# Altium schematic sheet keyboard_68.SchDoc
size A2
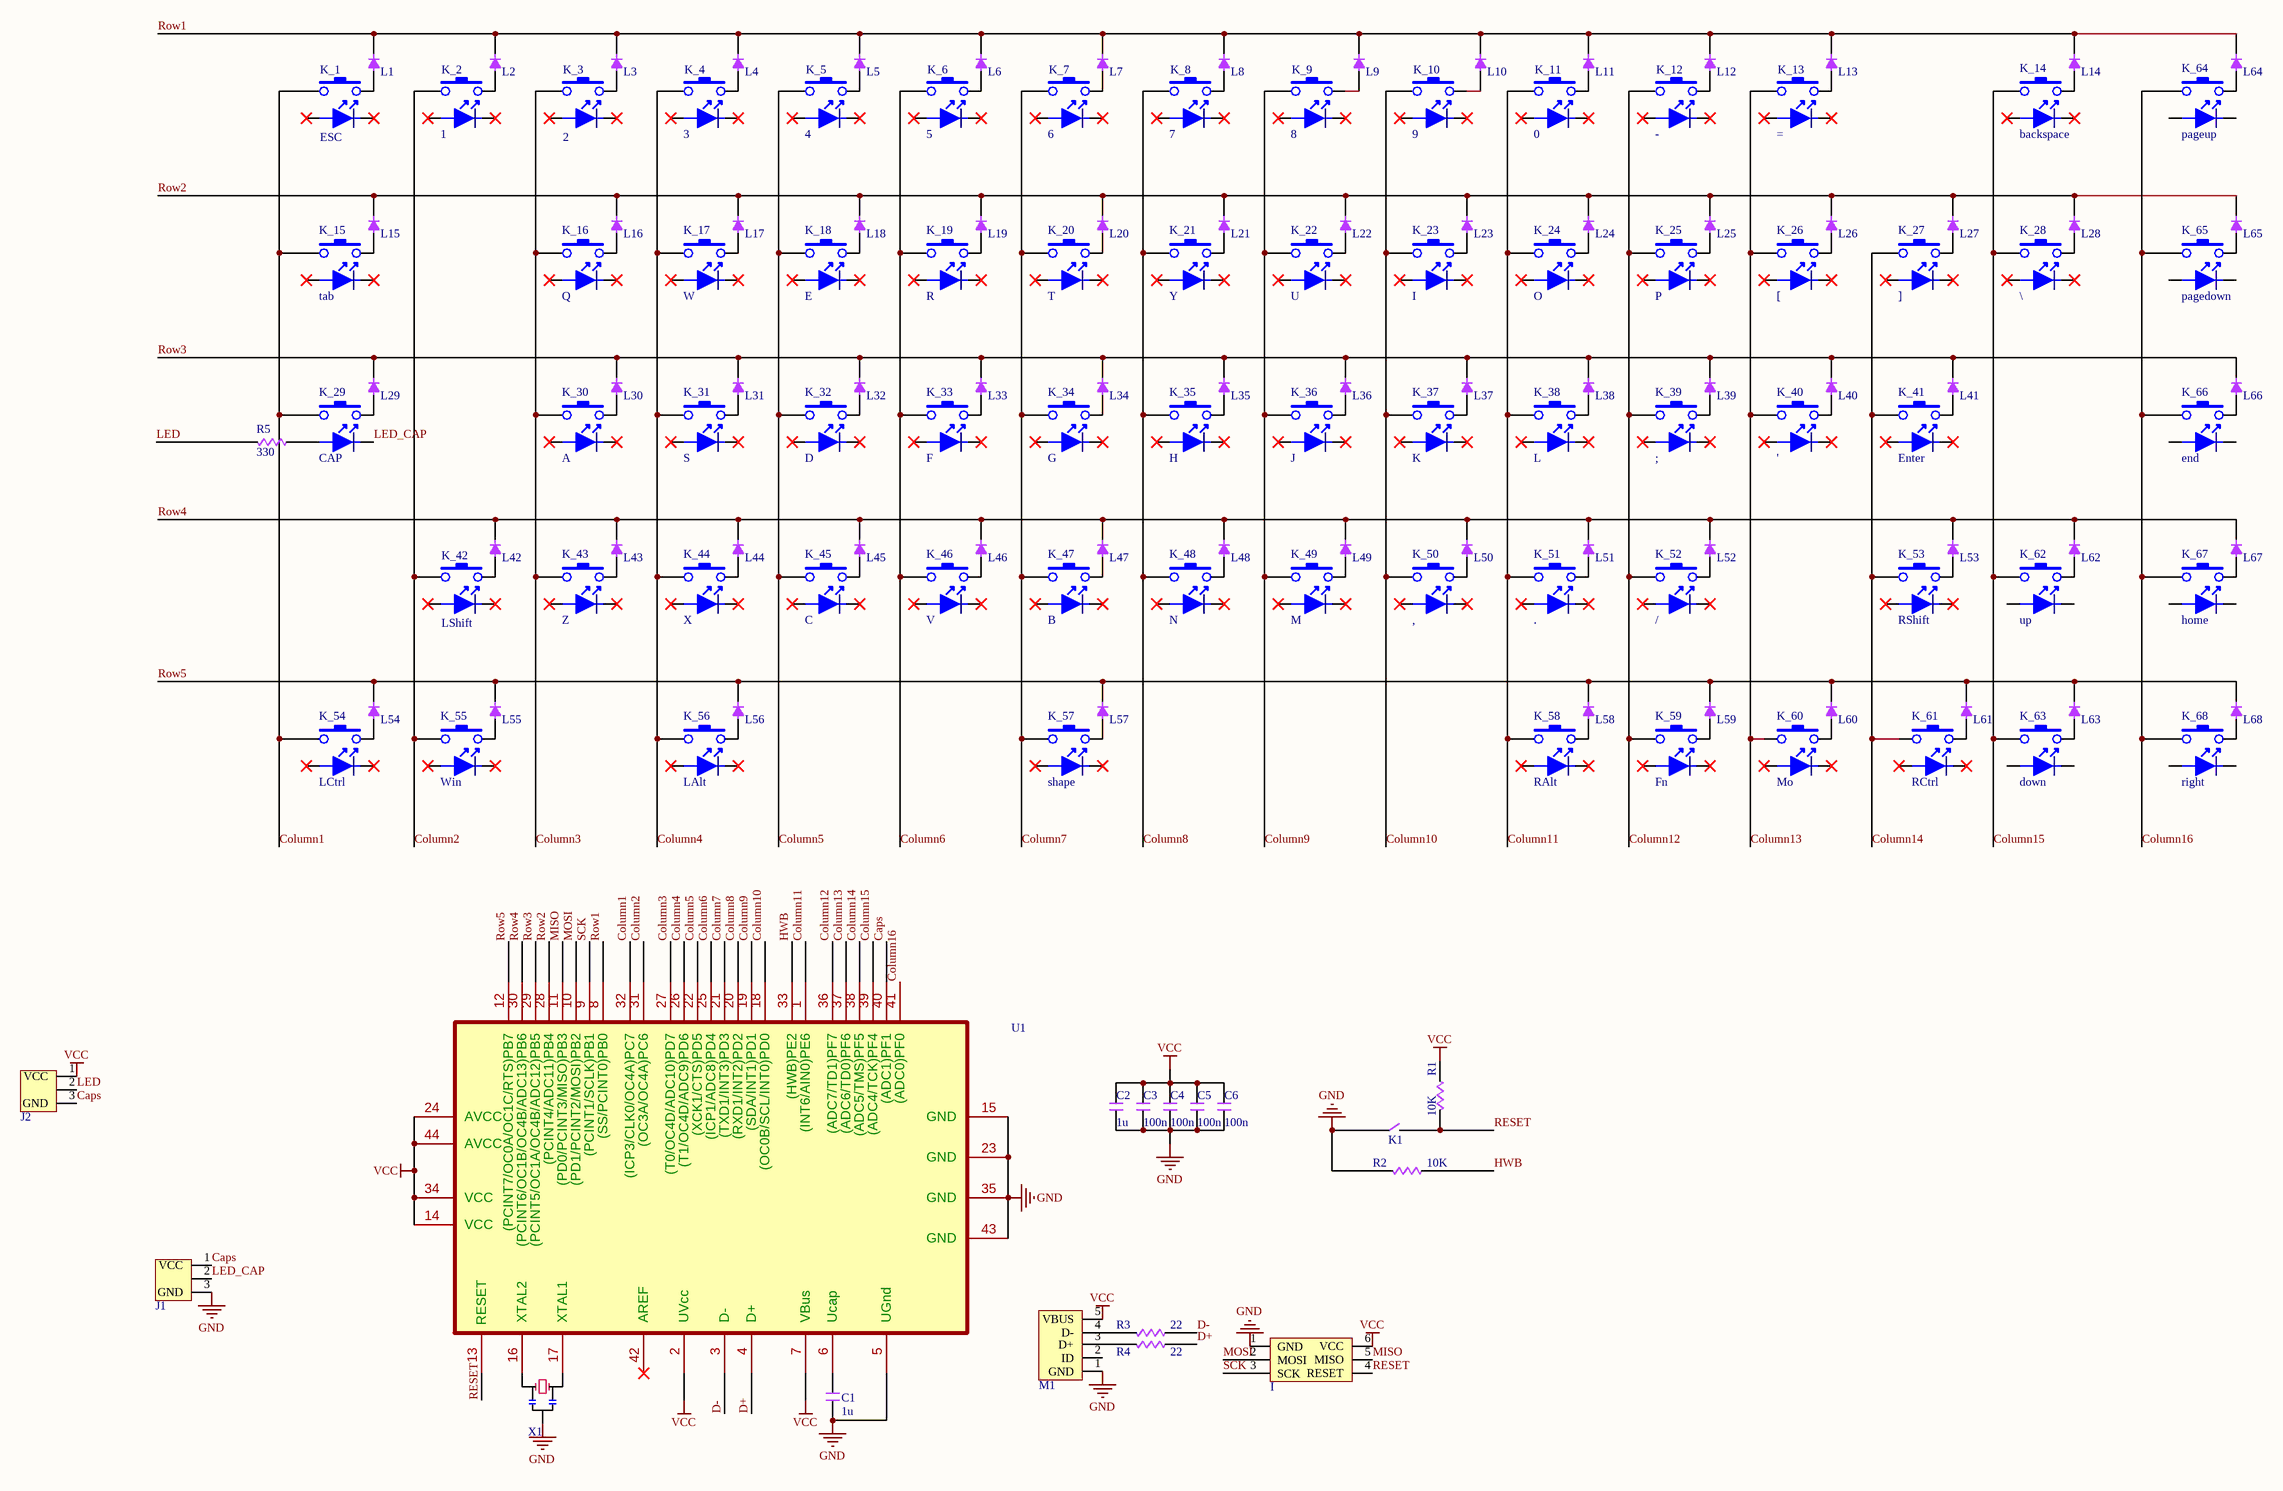
[diagram p0: keyboard_68.SchDoc]

## Parts
C1  value 1u  [C_0603]  (hidden comment: C)
C2  value 1u  [C_0603]  (hidden comment: C)
C3  value 100n  [C_0603]  (hidden comment: C)
C4  value 100n  [C_0603]  (hidden comment: C)
C5  value 100n  [C_0603]  (hidden comment: C)
C6  value 100n  [C_0603]  (hidden comment: C)
I  ISP  [ISP]  (value not drawn)
J1  Jump  [3PIN]  (value not drawn)
J2  Jump  [3PIN]  (value not drawn)
K1  SWITCH  [KEY]  (value not drawn)
K_1  ESC  [CHERRY]
K_2  1  [CHERRY]
K_3  2  [CHERRY]
K_4  3  [CHERRY]
K_5  4  [CHERRY]
K_6  5  [CHERRY]
K_7  6  [CHERRY]
K_8  7  [CHERRY]
K_9  8  [CHERRY]
K_10  9  [CHERRY]
K_11  0  [CHERRY]
K_12  -  [CHERRY]
K_13  (no value)  [CHERRY]
K_14  backspace  [KEY_CAP]
K_15  tab  [CHERRY]
K_16  Q  [CHERRY]
K_17  W  [CHERRY]
K_18  E  [CHERRY]
K_19  R  [CHERRY]
K_20  T  [CHERRY]
K_21  Y  [CHERRY]
K_22  U  [CHERRY]
K_23  I  [CHERRY]
K_24  O  [CHERRY]
K_25  P  [CHERRY]
K_26  [  [CHERRY]
K_27  ]  [CHERRY]
K_28  \  [CHERRY]
K_29  CAP  [CHERRY]
K_30  A  [CHERRY]
K_31  S  [CHERRY]
K_32  D  [CHERRY]
K_33  F  [CHERRY]
K_34  G  [CHERRY]
K_35  H  [CHERRY]
K_36  J  [CHERRY]
K_37  K  [CHERRY]
K_38  L  [CHERRY]
K_39  ;  [CHERRY]
K_40  '  [CHERRY]
K_41  Enter  [KEY_CAP]
K_42  LShift  [KEY_CAP]
K_43  Z  [CHERRY]
K_44  X  [CHERRY]
K_45  C  [CHERRY]
K_46  V  [CHERRY]
K_47  B  [CHERRY]
K_48  N  [CHERRY]
K_49  M  [CHERRY]
K_50  ,  [CHERRY]
K_51  .  [CHERRY]
K_52  /  [CHERRY]
K_53  RShift  [KEY_CAP]
K_54  LCtrl  [CHERRY]
K_55  Win  [CHERRY]
K_56  LAlt  [CHERRY]
K_57  shape  [SPACE_CAP]
K_58  RAlt  [CHERRY]
K_59  Fn  [CHERRY]
K_60  Mo  [CHERRY]
K_61  RCtrl  [CHERRY]
K_62  up  [CHERRY]
K_63  down  [CHERRY]
K_64  pageup  [CHERRY]
K_65  pagedown  [CHERRY]
K_66  end  [CHERRY]
K_67  home  [CHERRY]
K_68  right  [CHERRY]
L1  L  [L_0603]  (value not drawn)
L2  L  [L_0603]  (value not drawn)
L3  L  [L_0603]  (value not drawn)
L4  L  [L_0603]  (value not drawn)
L5  L  [L_0603]  (value not drawn)
L6  L  [L_0603]  (value not drawn)
L7  L  [L_0603]  (value not drawn)
L8  L  [L_0603]  (value not drawn)
L9  L  [L_0603]  (value not drawn)
L10  L  [L_0603]  (value not drawn)
L11  L  [L_0603]  (value not drawn)
L12  L  [L_0603]  (value not drawn)
L13  L  [L_0603]  (value not drawn)
L14  L  [L_0603]  (value not drawn)
L15  L  [L_0603]  (value not drawn)
L16  L  [L_0603]  (value not drawn)
L17  L  [L_0603]  (value not drawn)
L18  L  [L_0603]  (value not drawn)
L19  L  [L_0603]  (value not drawn)
L20  L  [L_0603]  (value not drawn)
L21  L  [L_0603]  (value not drawn)
L22  L  [L_0603]  (value not drawn)
L23  L  [L_0603]  (value not drawn)
L24  L  [L_0603]  (value not drawn)
L25  L  [L_0603]  (value not drawn)
L26  L  [L_0603]  (value not drawn)
L27  L  [L_0603]  (value not drawn)
L28  L  [L_0603]  (value not drawn)
L29  L  [L_0603]  (value not drawn)
L30  L  [L_0603]  (value not drawn)
L31  L  [L_0603]  (value not drawn)
L32  L  [L_0603]  (value not drawn)
L33  L  [L_0603]  (value not drawn)
L34  L  [L_0603]  (value not drawn)
L35  L  [L_0603]  (value not drawn)
L36  L  [L_0603]  (value not drawn)
L37  L  [L_0603]  (value not drawn)
L38  L  [L_0603]  (value not drawn)
L39  L  [L_0603]  (value not drawn)
L40  L  [L_0603]  (value not drawn)
L41  L  [L_0603]  (value not drawn)
L42  L  [L_0603]  (value not drawn)
L43  L  [L_0603]  (value not drawn)
L44  L  [L_0603]  (value not drawn)
L45  L  [L_0603]  (value not drawn)
L46  L  [L_0603]  (value not drawn)
L47  L  [L_0603]  (value not drawn)
L48  L  [L_0603]  (value not drawn)
L49  L  [L_0603]  (value not drawn)
L50  L  [L_0603]  (value not drawn)
L51  L  [L_0603]  (value not drawn)
L52  L  [L_0603]  (value not drawn)
L53  L  [L_0603]  (value not drawn)
L54  L  [L_0603]  (value not drawn)
L55  L  [L_0603]  (value not drawn)
L56  L  [L_0603]  (value not drawn)
L57  L  [L_0603]  (value not drawn)
L58  L  [L_0603]  (value not drawn)
L59  L  [L_0603]  (value not drawn)
L60  L  [L_0603]  (value not drawn)
L61  L  [L_0603]  (value not drawn)
L62  L  [L_0603]  (value not drawn)
L63  L  [L_0603]  (value not drawn)
L64  L  [L_0603]  (value not drawn)
L65  L  [L_0603]  (value not drawn)
L66  L  [L_0603]  (value not drawn)
L67  L  [L_0603]  (value not drawn)
L68  L  [L_0603]  (value not drawn)
M1  USB  [MICRO_USB]  (value not drawn)
R1  value 10K  [R_0603]  (hidden comment: R)
R2  value 10K  [R_0603]  (hidden comment: R)
R3  value 22  [R_0603]  (hidden comment: R)
R4  value 22  [R_0603]  (hidden comment: R)
R5  value 330  [R_0603]  (hidden comment: R)
U1  Atmega32U4  [TQFP80P1200X1200X120-44N]  (value not drawn)
X1  CSTCE  [CSTCE]  (value not drawn)

## Nets
GND: C1.1 C2.1 C3.1 C4.1 C5.1 C6.1 I.1(GND) J1.3(GND) K1.1(on) M1.1(GND) R2.1 U1.5(UGnd) U1.15(GND) U1.23(GND) U1.35(GND) U1.43(GND) X1.2(GND)
VCC: C2.2 C3.2 C4.2 C5.2 C6.2 I.6(VCC) J2.1(VCC) M1.5(VBUS) R1.2 U1.2(UVcc) U1.7(VBus) U1.14(VCC) U1.24(AVCC) U1.34(VCC) U1.44(AVCC)
Caps: J1.1(VCC) J2.3(GND) U1.40((ADC1)PF1)
Column1: K_1.1 K_15.1 K_29.1 K_54.1 U1.32((ICP3/CLK0/OC4A)PC7)
Column2: K_2.1 K_42.1 K_55.1 U1.31((OC3A/OC4A)PC6)
Column3: K_3.1 K_16.1 K_30.1 K_43.1 U1.27((T0/OC4D/ADC10)PD7)
Column4: K_4.1 K_17.1 K_31.1 K_44.1 K_56.1 U1.26((T1/OC4D/ADC9)PD6)
Column5: K_5.1 K_18.1 K_32.1 K_45.1 U1.22((XCK1/CTS)PD5)
Column6: K_6.1 K_19.1 K_33.1 K_46.1 U1.25((ICP1/ADC8)PD4)
Column7: K_7.1 K_20.1 K_34.1 K_47.1 K_57.1 U1.21((TXD1/INT3)PD3)
Column8: K_8.1 K_21.1 K_35.1 K_48.1 U1.20((RXD1/INT2)PD2)
Column9: K_9.1 K_22.1 K_36.1 K_49.1 U1.19((SDA/INT1)PD1)
Column10: K_10.1 K_23.1 K_37.1 K_50.1 U1.18((OC0B/SCL/INT0)PD0)
Column11: K_11.1 K_24.1 K_38.1 K_51.1 K_58.1 U1.1((INT6/AIN0)PE6)
Column12: K_12.1 K_25.1 K_39.1 K_52.1 K_59.1 U1.36((ADC7/TD1)PF7)
Column13: K_13.1 K_26.1 K_40.1 K_60.1 U1.37((ADC6/TD0)PF6)
Column14: K_27.1 K_41.1 K_53.1 K_61.1 U1.38((ADC5/TMS)PF5)
Column15: K_14.1 K_28.1 K_62.1 K_63.1 U1.39((ADC4/TCK)PF4)
Column16: K_64.1 K_65.1 K_66.1 K_67.1 K_68.1 U1.41((ADC0)PF0)
D+: R4.2 U1.4(D+)
D-: R3.2 U1.3(D-)
HWB: R2.2 U1.33((HWB)PE2)
LED: J2.2(MISO) R5.1
LED_CAP: J1.2(MISO) K_29.4
MISO: I.5(MISO) U1.11((PD0/PCINT3/MISO)PB3)
MOSI: I.2(MOSI) U1.10((PD1/PCINT2/MOSI)PB2)
RESET: I.4(RESET) K1.2(off) R1.1 U1.13(RESET)
Row1: L1.2 L2.2 L3.2 L4.2 L5.2 L6.2 L7.2 L8.2 L9.2 L10.2 L11.2 L12.2 L13.2 L14.2 L64.2 U1.8((SS/PCINT0)PB0)
Row2: L15.2 L16.2 L17.2 L18.2 L19.2 L20.2 L21.2 L22.2 L23.2 L24.2 L25.2 L26.2 L27.2 L28.2 L65.2 U1.28((PCINT4/ADC11)PB4)
Row3: L29.2 L30.2 L31.2 L32.2 L33.2 L34.2 L35.2 L36.2 L37.2 L38.2 L39.2 L40.2 L41.2 L66.2 U1.29((PCINT5/OC1A/OC4B/ADC12)PB5)
Row4: L42.2 L43.2 L44.2 L45.2 L46.2 L47.2 L48.2 L49.2 L50.2 L51.2 L52.2 L53.2 L62.2 L67.2 U1.30((PCINT6/OC1B/OC4B/ADC13)PB6)
Row5: L54.2 L55.2 L56.2 L57.2 L58.2 L59.2 L60.2 L61.2 L63.2 L68.2 U1.12((PCINT7/OC0A/OC1C/RTS)PB7)
SCK: I.3(SCK) U1.9((PCINT1/SCLK)PB1)
NetC1_2: C1.2 U1.6(Ucap)
NetK_1_2: K_1.2 L1.1(+)
NetK_2_2: K_2.2 L2.1(+)
NetK_3_2: K_3.2 L3.1(+)
NetK_4_2: K_4.2 L4.1(+)
NetK_5_2: K_5.2 L5.1(+)
NetK_6_2: K_6.2 L6.1(+)
NetK_7_2: K_7.2 L7.1(+)
NetK_8_2: K_8.2 L8.1(+)
NetK_9_2: K_9.2 L9.1(+)
NetK_10_2: K_10.2 L10.1(+)
NetK_11_2: K_11.2 L11.1(+)
NetK_12_2: K_12.2 L12.1(+)
NetK_13_2: K_13.2 L13.1(+)
NetK_14_2: K_14.2 L14.1(+)
NetK_15_2: K_15.2 L15.1(+)
NetK_16_2: K_16.2 L16.1(+)
NetK_17_2: K_17.2 L17.1(+)
NetK_18_2: K_18.2 L18.1(+)
NetK_19_2: K_19.2 L19.1(+)
NetK_20_2: K_20.2 L20.1(+)
NetK_21_2: K_21.2 L21.1(+)
NetK_22_2: K_22.2 L22.1(+)
NetK_23_2: K_23.2 L23.1(+)
NetK_24_2: K_24.2 L24.1(+)
NetK_25_2: K_25.2 L25.1(+)
NetK_26_2: K_26.2 L26.1(+)
NetK_27_2: K_27.2 L27.1(+)
NetK_28_2: K_28.2 L28.1(+)
NetK_29_2: K_29.2 L29.1(+)
NetK_29_3: K_29.3 R5.2
NetK_30_2: K_30.2 L30.1(+)
NetK_31_2: K_31.2 L31.1(+)
NetK_32_2: K_32.2 L32.1(+)
NetK_33_2: K_33.2 L33.1(+)
NetK_34_2: K_34.2 L34.1(+)
NetK_35_2: K_35.2 L35.1(+)
NetK_36_2: K_36.2 L36.1(+)
NetK_37_2: K_37.2 L37.1(+)
NetK_38_2: K_38.2 L38.1(+)
NetK_39_2: K_39.2 L39.1(+)
NetK_40_2: K_40.2 L40.1(+)
NetK_41_2: K_41.2 L41.1(+)
NetK_42_2: K_42.2 L42.1(+)
NetK_43_2: K_43.2 L43.1(+)
NetK_44_2: K_44.2 L44.1(+)
NetK_45_2: K_45.2 L45.1(+)
NetK_46_2: K_46.2 L46.1(+)
NetK_47_2: K_47.2 L47.1(+)
NetK_48_2: K_48.2 L48.1(+)
NetK_49_2: K_49.2 L49.1(+)
NetK_50_2: K_50.2 L50.1(+)
NetK_51_2: K_51.2 L51.1(+)
NetK_52_2: K_52.2 L52.1(+)
NetK_53_2: K_53.2 L53.1(+)
NetK_54_2: K_54.2 L54.1(+)
NetK_55_2: K_55.2 L55.1(+)
NetK_56_2: K_56.2 L56.1(+)
NetK_57_2: K_57.2 L57.1(+)
NetK_58_2: K_58.2 L58.1(+)
NetK_59_2: K_59.2 L59.1(+)
NetK_60_2: K_60.2 L60.1(+)
NetK_61_2: K_61.2 L61.1(+)
NetK_62_2: K_62.2 L62.1(+)
NetK_63_2: K_63.2 L63.1(+)
NetK_64_2: K_64.2 L64.1(+)
NetK_65_2: K_65.2 L65.1(+)
NetK_66_2: K_66.2 L66.1(+)
NetK_67_2: K_67.2 L67.1(+)
NetK_68_2: K_68.2 L68.1(+)
NetM1_3: M1.3(D+) R4.1
NetM1_4: M1.4(D-) R3.1
NetU1_16: U1.16(XTAL2) X1.1(IN)
NetU1_17: U1.17(XTAL1) X1.3(OUT)

Not connected (* = marked no-connect by the designer): K_1 3* 4*; K_2 3* 4*; K_3 3* 4*; K_4 3* 4*; K_5 3* 4*; K_6 3* 4*; K_7 3* 4*; K_8 3* 4*; K_9 3* 4*; K_10 3* 4*; K_11 3* 4*; K_12 3* 4*; K_13 3* 4*; K_14 3* 4*; K_15 3* 4*; K_16 3* 4*; K_17 3* 4*; K_18 3* 4*; K_19 3* 4*; K_20 3* 4*; K_21 3* 4*; K_22 3* 4*; K_23 3* 4*; K_24 3* 4*; K_25 3* 4*; K_26 3* 4*; K_27 3* 4*; K_28 3* 4*; K_30 3* 4*; K_31 3* 4*; K_32 3* 4*; K_33 3* 4*; K_34 3* 4*; K_35 3* 4*; K_36 3* 4*; K_37 3* 4*; K_38 3* 4*; K_39 3* 4*; K_40 3* 4*; K_41 3* 4*; K_42 3* 4*; K_43 3* 4*; K_44 3* 4*; K_45 3* 4*; K_46 3* 4*; K_47 3* 4*; K_48 3* 4*; K_49 3* 4*; K_50 3* 4*; K_51 3* 4*; K_52 3* 4*; K_53 3* 4*; K_54 3* 4*; K_55 3* 4*; K_56 3* 4*; K_57 3* 4*; K_58 3* 4*; K_59 3* 4*; K_60 3* 4*; K_61 3* 4*; K_62 3 4; K_63 3 4; K_64 3 4; K_65 3 4; K_66 3 4; K_67 3 4; K_68 3 4; M1 2(ID); U1 42(AREF)*

## Library data of the parts
C1-C6 = 0603_C
J1 J2 = 3PIN
K1 = KEY
K_1-K_13 K_15-K_40 K_43-K_52 K_54-K_56 K_58-K_68 = Cherry
K_14 K_41 K_42 K_53 = SHIFT
L1-L68 = 0603_L
M1 = MICRO_USB
R1-R5 = 0603_R
U1 = LQFP44(ATMEGA32U4)